# Altium schematic sheet RelayModule_RELAY.SchDoc
size 594 x 420 mm; DocumentNumber: VSL.23-RELAYMODULE Э3; SheetNumber: 2; Format: A2
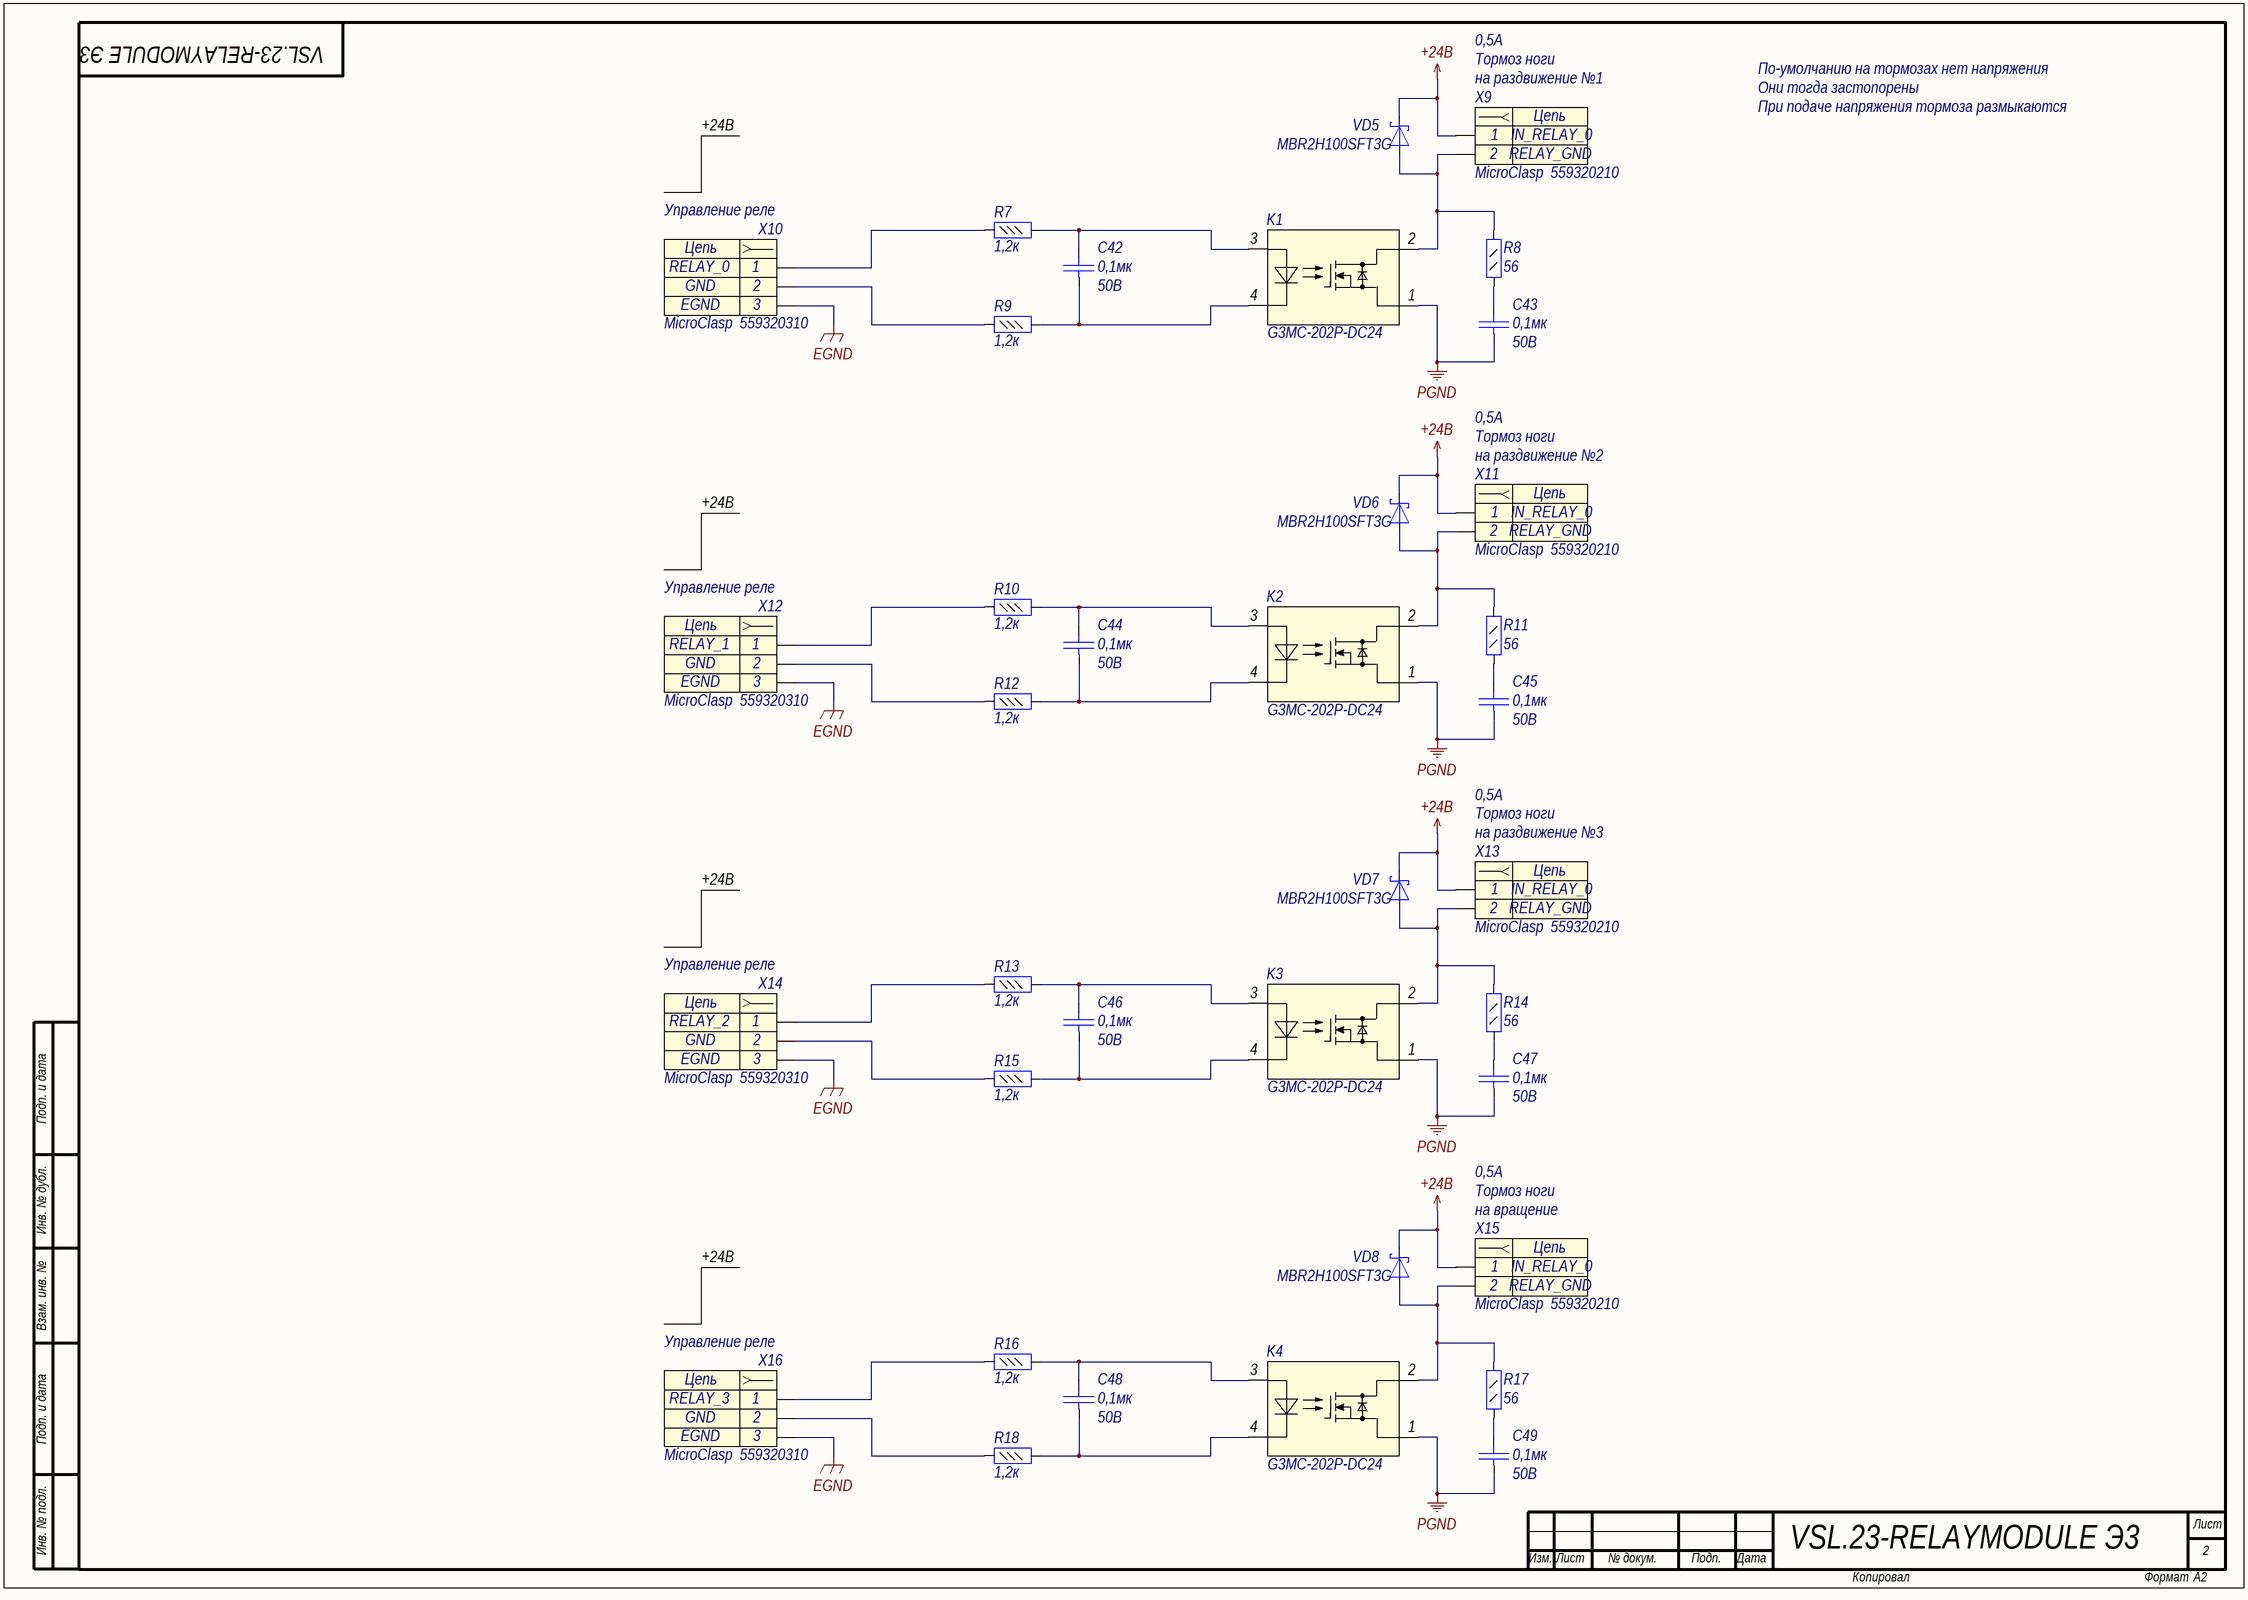
[diagram p0: RelayModule_RELAY.SchDoc]

## Parts
C42  Voltage: 50В  [C0402]  (hidden comment: 0,1мк)
C43  Voltage: 50В  [C0402]  (hidden comment: 0,1мк)
C44  Voltage: 50В  [C0402]  (hidden comment: 0,1мк)
C45  Voltage: 50В  [C0402]  (hidden comment: 0,1мк)
C46  Voltage: 50В  [C0402]  (hidden comment: 0,1мк)
C47  Voltage: 50В  [C0402]  (hidden comment: 0,1мк)
C48  Voltage: 50В  [C0402]  (hidden comment: 0,1мк)
C49  Voltage: 50В  [C0402]  (hidden comment: 0,1мк)
K1  Part Number: G3MC-202P-DC24  [SIP4]  (hidden comment: Relay_SSR)
K2  Part Number: G3MC-202P-DC24  [SIP4]  (hidden comment: Relay_SSR)
K3  Part Number: G3MC-202P-DC24  [SIP4]  (hidden comment: Relay_SSR)
K4  Part Number: G3MC-202P-DC24  [SIP4]  (hidden comment: Relay_SSR)
R7  value 1,2к  [R0402]  (hidden comment: Resistor_0,062Вт)
R8  value 56  [R0805]  (hidden comment: Resistor_0,125Вт)
R9  value 1,2к  [R0402]  (hidden comment: Resistor_0,062Вт)
R10  value 1,2к  [R0402]  (hidden comment: Resistor_0,062Вт)
R11  value 56  [R0805]  (hidden comment: Resistor_0,125Вт)
R12  value 1,2к  [R0402]  (hidden comment: Resistor_0,062Вт)
R13  value 1,2к  [R0402]  (hidden comment: Resistor_0,062Вт)
R14  value 56  [R0805]  (hidden comment: Resistor_0,125Вт)
R15  value 1,2к  [R0402]  (hidden comment: Resistor_0,062Вт)
R16  value 1,2к  [R0402]  (hidden comment: Resistor_0,062Вт)
R17  value 56  [R0805]  (hidden comment: Resistor_0,125Вт)
R18  value 1,2к  [R0402]  (hidden comment: Resistor_0,062Вт)
VD5  Part Number: MBR2H100SFT3G  [SOD-123]  (hidden comment: DiodeSchottky)
VD6  Part Number: MBR2H100SFT3G  [SOD-123]  (hidden comment: DiodeSchottky)
VD7  Part Number: MBR2H100SFT3G  [SOD-123]  (hidden comment: DiodeSchottky)
VD8  Part Number: MBR2H100SFT3G  [SOD-123]  (hidden comment: DiodeSchottky)
X9  Part Name: MicroClasp  Part Number: 559320210  [MOLEX_559320210]  (hidden comment: Header_2_sct)
X10  Управление реле  Part Name: MicroClasp  Part Number: 559320310  [MOLEX_559320310]
X11  Part Name: MicroClasp  Part Number: 559320210  [MOLEX_559320210]  (hidden comment: Header_2_sct)
X12  Управление реле  Part Name: MicroClasp  Part Number: 559320310  [MOLEX_559320310]
X13  Part Name: MicroClasp  Part Number: 559320210  [MOLEX_559320210]  (hidden comment: Header_2_sct)
X14  Управление реле  Part Name: MicroClasp  Part Number: 559320310  [MOLEX_559320310]
X15  Part Name: MicroClasp  Part Number: 559320210  [MOLEX_559320210]  (hidden comment: Header_2_sct)
X16  Управление реле  Part Name: MicroClasp  Part Number: 559320310  [MOLEX_559320310]

## Nets
+24B: VD5.1(K) VD6.1(K) VD7.1(K) VD8.1(K) X9.1 X11.1 X13.1 X15.1
EGND: X10.3 X12.3 X14.3 X16.3
PGND: C43.1 C45.1 C47.1 C49.1 K1.1 K2.1 K3.1 K4.1
NetC42_1: C42.1 K1.4 R9.2
NetC42_2: C42.2 K1.3(+) R7.2
NetC43_2: C43.2 R8.1
NetC44_1: C44.1 K2.4 R12.2
NetC44_2: C44.2 K2.3(+) R10.2
NetC45_2: C45.2 R11.1
NetC46_1: C46.1 K3.4 R15.2
NetC46_2: C46.2 K3.3(+) R13.2
NetC47_2: C47.2 R14.1
NetC48_1: C48.1 K4.4 R18.2
NetC48_2: C48.2 K4.3(+) R16.2
NetC49_2: C49.2 R17.1
NetK1_2: K1.2 R8.2 VD5.2(A) X9.2
NetK2_2: K2.2 R11.2 VD6.2(A) X11.2
NetK3_2: K3.2 R14.2 VD7.2(A) X13.2
NetK4_2: K4.2 R17.2 VD8.2(A) X15.2
NetR7_1: R7.1 X10.1
NetR9_1: R9.1 X10.2
NetR10_1: R10.1 X12.1
NetR12_1: R12.1 X12.2
NetR13_1: R13.1 X14.1
NetR15_1: R15.1 X14.2
NetR16_1: R16.1 X16.1
NetR18_1: R18.1 X16.2

## Notes on the sheet
- Тормоз ноги
- 0,5А
- на раздвижение №1
- По-умолчанию на тормозах нет напряжения
- Они тогда застопорены
- При подаче напряжения тормоза размыкаются
- +24B
- на раздвижение №2
- на раздвижение №3
- Подп. и дата
- Инв. № дубл.
- на вращение
- Взам. инв. №
- Инв. № подл.
- Лист
- Изм.
- № докум.
- Подп.
- Дата
- Копировал
- Формат
- (in symbol connect95) Цепь
- (in symbol connect96) Цепь

## Library data of the parts
C42-C49 = cap277: Конденсатор; Part Name: Ceramic; Manufacture: Murata; Part Number: GRM155R71H104KE14D; id: cap277; TKE: X7R; tga: 0,10%; Value: 0,1мк
K1-K4 = relay2: Твердотельное реле; Part Name: Твердотельные реле; Manufacture: Omron; id: relay2; Voltage coil: 24B; Nom contact current: 2A; Contact Voltage: 19-28B
R7 R9 R10 R12 R13 R15 R16 R18 = res272: Резистор; Manufacture: Yageo; Part Number: RC0402FR-071K2; id: res272; Accuracy: 0,01; Part Name: Resistor; Power: 0,062Вт
R8 R11 R14 R17 = res43: Резистор; Manufacture: Yageo; Part Number: RC0805FR-0756RL; id: res43; Accuracy: 0,01; Part Name: Resistor; Power: 0,125Вт
VD5-VD8 = diode27: Диод Шоттки; Manufacture: ON Semiconductor; Max Reverse Voltage: 100B; Forward Current: 2А; Breakdown Current: 0,5mA; Number of Channels: 1; id: diode27; Part Name: Diode Schottky; Breakdown Voltage: 100B
X9 X11 X13 X15 = connect95: Разъем - 2 конт. розетка; Manufacture: Molex; Contact_1: IN_RELAY_0; Contact_2: RELAY_GND; Etch: 2mm; id: connect95
X10 = connect96: Разъем - 3 конт. розетка; Manufacture: Molex; Contact_1: RELAY_0; Contact_2: GND; Contact_3: EGND; Etch: 2mm; id: connect96
X12 = connect96: Разъем - 3 конт. розетка; Manufacture: Molex; Contact_1: RELAY_1; Contact_2: GND; Contact_3: EGND; Etch: 2mm; id: connect96
X14 = connect96: Разъем - 3 конт. розетка; Manufacture: Molex; Contact_1: RELAY_2; Contact_2: GND; Contact_3: EGND; Etch: 2mm; id: connect96
X16 = connect96: Разъем - 3 конт. розетка; Manufacture: Molex; Contact_1: RELAY_3; Contact_2: GND; Contact_3: EGND; Etch: 2mm; id: connect96